# Altium schematic sheet TV_Measure.SchDoc
size A3; SheetNumber: 1; SheetTotal: 1
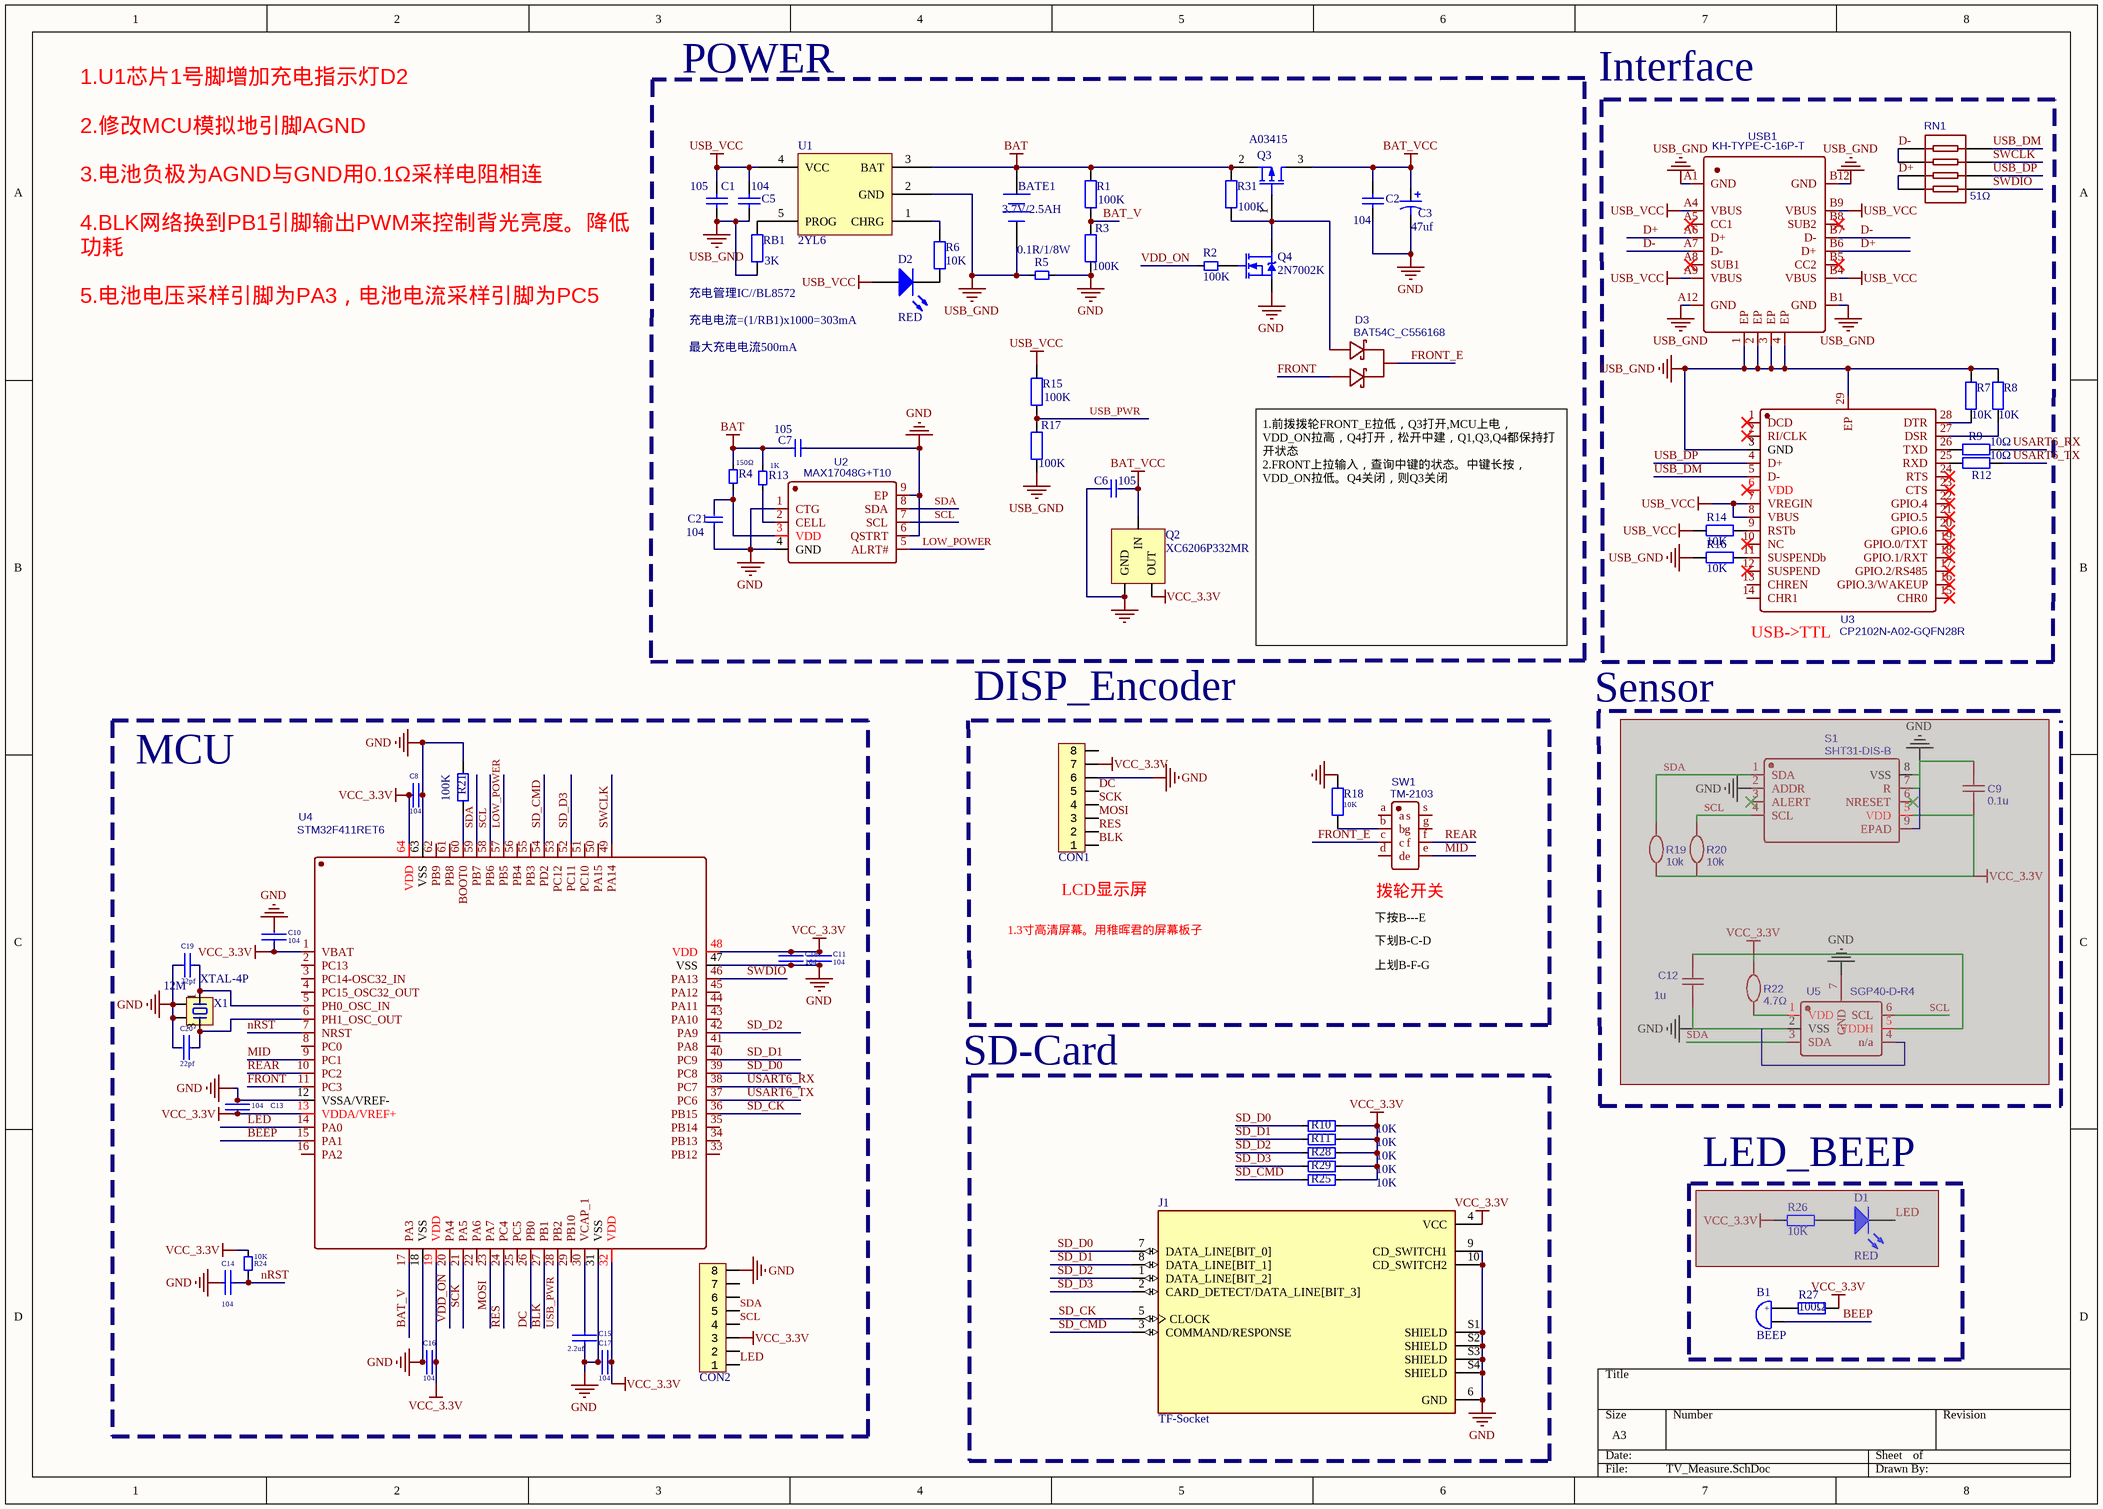
[diagram p0: TV_Measure.SchDoc]

## Parts
B1  BEEP  [BEEP_SMD5020]
BATE1  3.7V/2.5AH  [XH2/2.54mm/180]
C1  105  [0402_C]
C2  104  [0402_C]
C3  47uf  [TAJ-A/3216]
C5  104  [0402_C]
C6  105  [0402_C]
C7  105  [0402_C]
C8  104  [0402_C]
C9  0.1u  [0402_C]  (masked out: inside a compile mask, not in the netlist)
C10  104  [0402_C]
C11  104  [0402_C]
C12  1u  [0402_C]  (masked out: inside a compile mask, not in the netlist)
C13  104  [0402_C]
C14  104  [0402_C]
C15  2.2uf  [0402_C]
C16  104  [0402_C]
C17  104  [0402_C]
C18  104  [0402_C]
C19  22pf  [0402_C]
C20  22pf  [0402_C]
C21  104  [0402_C]
CON1  FFC_0.5_8  [FFC_0.5_8]  (value not drawn)
CON2  FFC_0.5_8  [FFC_0.5_8]  (value not drawn)
D1  RED  [LED_0402_BLUE]  (masked out: inside a compile mask, not in the netlist)
D2  RED  [LED_0402_BLUE]
D3  BAT54C_C556168  [SOT23_]
J1  TF-Socket  [TF_Card]
Q2  XC6206P332MR  [SOT23_]
Q3  A03415  [SOT23_]
Q4  2N7002K  [SOT23_]
R1  100K  [0402_R]
R2  100K  [0402_R]
R3  100K  [0402_R]
R4  150Ω  [0402_R]
R5  0.1R/1/8W  [0805R]
R6  10K  [0402_R]
R7  10K  [0402_R]
R8  10K  [0402_R]
R9  10Ω  [0402_R]
R10  10K  [0402_R]
R11  10K  [0402_R]
R12  10Ω  [0402_R]
R13  1K  [0402_R]
R14  10K  [0402_R]
R15  100K  [0402_R]
R16  10K  [0402_R]
R17  100K  [0402_R]
R18  10K  [0402_R]
R19  10k  [0402_R]  (masked out: inside a compile mask, not in the netlist)
R20  10k  [0402_R]  (masked out: inside a compile mask, not in the netlist)
R21  100K  [0402_R]
R22  4.7Ω  [0402_R]  (masked out: inside a compile mask, not in the netlist)
R24  10K  [0402_R]
R25  10K  [0402_R]
R26  10K  [0402_R]  (masked out: inside a compile mask, not in the netlist)
R27  100Ω  [0402_R]
R28  10K  [0402_R]
R29  10K  [0402_R]
R31  100K  [0402_R]
RB1  3K  [0402_R]
RN1  51Ω  [0603R*4_r]
S1  SHT31-DIS-B  [DFN8-P0.50]  (masked out: inside a compile mask, not in the netlist)
SW1  TM-2103  [WHEEL_SWITCH]
U1  2YL6  [SOT23-5_S]
U2  MAX17048G+T10  [DFN-8_L2.0-W2.0-P0.50-BL-EP]
U3  CP2102N-A02-GQFN28R  [QFN28]
U4  STM32F411RET6  [LQFP-64_L10.0-W10.0-P0.50-LS12.0-BL]
U5  SGP40-D-R4  [DFN-6_L2.4-W2.4-P0.80-TL-EP]  (masked out: inside a compile mask, not in the netlist)
USB1  KH-TYPE-C-16P-T  [TYPE-C-16P-T]
X1  XTAL-4P  [OSC 3225-4P]

## Blocks framed on the sheet
POWER: BATE1 C1-C3 C5-C7 C21 D2 D3 Q2-Q4 R1-R6 R13 R15 R17 R31 RB1 U1 U2
Interface: R7-R9 R12 R14 R16 RN1 U3 USB1
MCU: C8 C10 C11 C13-C20 CON2 R21 R24 U4 X1
LED_BEEP: B1 D1 R26 R27

## Nets
BAT: BATE1.1(+) C7.2 Q3.2 R1.2 R4.1 R13.1 R31.2 U1.3(BAT)
BAT_VCC: C2.2 C3.1 C6.1 Q2.3(IN) Q3.3
GND: C2.1 C3.2 C6.2 C7.1 C8.1 C10.1 C11.1 C13.1 C14.1 C15.1 C16.1 C17.1 C18.1 C19.1 C20.1 C21.2 CON1.6 CON2.8 J1.6(GND) J1.9(CD_SWITCH1) J1.10(CD_SWITCH2) J1.S1(SHIELD) J1.S2(SHIELD) J1.S3(SHIELD) J1.S4(SHIELD) Q2.1(GND) Q4.2(S) R3.1 R5.2 R18.2 R21.1 U2.1(CTG) U2.4(GND) U2.6(QSTRT) U2.9(EP) U4.12(VSSA/VREF-) U4.18(VSS) U4.31(VSS) U4.47(VSS) U4.63(VSS) X1.2 X1.4
USB_GND: BATE1.2(-) C1.2 C5.2 R5.1 R7.1 R8.1 R16.2 R17.1 RB1.1 U1.2(GND) U3.3(GND) U3.29(EP) USB1.1(EP) USB1.2(EP) USB1.3(EP) USB1.4(EP) USB1.A1(GND) USB1.A12(GND) USB1.B1(GND) USB1.B12(GND)
USB_VCC: C1.1 C5.1 D2.1(A) R14.1 R15.2 U1.4(VCC) U3.7(VREGIN) U3.8(VBUS) USB1.A4(VBUS) USB1.A9(VBUS) USB1.B4(VBUS) USB1.B9(VBUS)
VCC_3.3V: C8.2 C10.2 C11.2 C13.2 C16.2 C17.2 C18.2 CON1.7 CON2.3 J1.4(VCC) Q2.2(OUT) R10.1 R11.1 R24.2 R25.1 R27.1 R28.1 R29.1 U4.1(VBAT) U4.13(VDDA/VREF+) U4.19(VDD) U4.32(VDD) U4.48(VDD) U4.64(VDD)
BAT_V: R1.1 R3.2 U4.17(PA3)
BEEP: B1.2 U4.15(PA1)
BLK: CON1.1 U4.27(PB1)
D+: RN1.3 RN1.4 USB1.A6(D+) USB1.B6(D+)
D-: RN1.1 RN1.2 USB1.A7(D-) USB1.B7(D-)
DC: CON1.5 U4.26(PB0)
FRONT: D3.2(+) U4.11(PC3)
FRONT_E: D3.3(-) SW1.c
LED: CON2.1 U4.14(PA0)
LOW_POWER: U2.5(ALRT#) U4.57(PB5)
MID: SW1.e U4.9(PC1)
MOSI: CON1.3 U4.23(PA7)
nRST: C14.2 R24.1 U4.7(NRST)
REAR: SW1.f U4.10(PC2)
RES: CON1.2 U4.24(PC4)
SCK: CON1.4 U4.21(PA5)
SCL: CON2.4 U2.7(SCL) U4.58(PB6)
SD_CK: J1.5(CLOCK) U4.36(PB15)
SD_CMD: J1.3(COMMAND/RESPONSE) R25.2 U4.54(PD2)
SD_D0: J1.7(DATA_LINE[BIT_0]) R10.2 U4.39(PC8)
SD_D1: J1.8(DATA_LINE[BIT_1]) R11.2 U4.40(PC9)
SD_D2: J1.1(DATA_LINE[BIT_2]) R28.2 U4.42(PA9)
SD_D3: J1.2(CARD_DETECT/DATA_LINE[BIT_3]) R29.2 U4.52(PC11)
SDA: CON2.5 U2.8(SDA) U4.59(PB7)
SWCLK: RN1.7 U4.49(PA14)
SWDIO: RN1.5 U4.46(PA13)
USART6_RX: R9.2 U4.38(PC7)
USART6_TX: R12.2 U4.37(PC6)
USB_DM: RN1.8 U3.5(D-)
USB_DP: RN1.6 U3.4(D+)
USB_PWR: R15.1 R17.2 U4.28(PB2)
VDD_ON: R2.2 U4.20(PA4)
NetB1_1: B1.1 R27.2
NetC15_2: C15.2 U4.30(VCAP_1)
NetC19_2: C19.2 U4.5(PH0_OSC_IN) X1.1
NetC20_2: C20.2 U4.6(PH1_OSC_OUT) X1.3
NetC21_1: C21.1 R4.2 U2.3(VDD)
NetD2_2: D2.2(K) R6.2
NetD3_1: D3.1(+) Q3.1 Q4.3(D) R31.1
NetQ4_1: Q4.1(G) R2.1
NetR6_1: R6.1 U1.1(CHRG)
NetR7_2: R7.2 U3.28(DTR)
NetR8_2: R8.2 U3.27(DSR)
NetR9_1: R9.1 U3.26(TXD)
NetR12_1: R12.1 U3.25(RXD)
NetR13_2: R13.2 U2.2(CELL)
NetR14_2: R14.2 U3.9(RSTb)
NetR16_1: R16.1 U3.11(SUSPENDb)
NetR18_1: R18.1 SW1.b
NetR21_2: R21.2 U4.60(BOOT0)
NetRB1_2: RB1.2 U1.5(PROG)

Not connected (* = marked no-connect by the designer): CON1 8; CON2 2 6 7; SW1 a d g s; U3 1(DCD)* 2(RI/CLK)* 6(VDD)* 10(NC)* 12(SUSPEND)* 13(CHREN) 14(CHR1) 15(CHR0)* 16(GPIO.3/WAKEUP)* 17(GPIO.2/RS485)* 18(GPIO.1/RXT)* 19(GPIO.0/TXT)* 20(GPIO.6)* 21(GPIO.5)* 22(GPIO.4)* 23(CTS)* 24(RTS)*; U4 2(PC13) 3(PC14-OSC32_IN) 4(PC15_OSC32_OUT) 8(PC0) 16(PA2) 22(PA6) 25(PC5) 29(PB10) 33(PB12) 34(PB13) 35(PB14) 41(PA8) 43(PA10) 44(PA11) 45(PA12) 50(PA15) 51(PC10) 53(PC12) 55(PB3) 56(PB4) 61(PB8) 62(PB9); USB1 A5(CC1)* A8(SUB1)* B5(CC2)* B8(SUB2)*

## Notes on the sheet
- (near RB1) 充电管理IC//BL8572
- 充电电流=(1/RB1)x1000=303mA
- 最大充电电流500mA
- (near D3) 1.前拨拨轮FRONT_E拉低，Q3打开,MCU上电，VDD_ON拉高，Q4打开，松开中建，Q1,Q3,Q4都保持打开状态
  2.FRONT上拉输入，查询中键的状态。中键长按，VDD_ON拉低。Q4关闭，则Q3关闭
- (near U3) USB->TTL
- 1.U1芯片1号脚增加充电指示灯D2
  2.修改MCU模拟地引脚AGND
  3.电池负极为AGND与GND用0.1Ω采样电阻相连
  4.BLK网络换到PB1引脚输出PWM来控制背光亮度。降低功耗
  5.电池电压采样引脚为PA3，电池电流采样引脚为PC5
- (near CON1) DISP_Encoder
- Sensor
- (near CON1) LCD显示屏
- (near SW1) 下按B---E
- (near SW1) 拨轮开关
- 12M
- 1.3寸高清屏幕。用稚晖君的屏幕板子
- 下划B-C-D
- 上划B-F-G
- SD-Card
- (in symbol BEEP) +

## Library data of the parts
B1 = BEEP: 蜂鸣器
BATE1 = Battery: Multicell Battery; Published: 24-Mar-1999; LatestRevisionDate: 17-Jul-2002; LatestRevisionNote: Re-released for DXP Platform.; PackageReference: BAT-2; Publisher: Altium Limited
C1 C2 C5 = Cap: Capacitor; Published: 8-Jun-2000; LatestRevisionDate: 17-Jul-2002; LatestRevisionNote: Re-released for DXP Platform.; PackageReference: RAD-0.3; Publisher: Altium Limited
  C1: Value: 105
  C2 C5: Value: 104
C3 = Cap Pol3: Polarized Capacitor (Surface Mount); Value: 100pF; Published: 8-Jun-2000; LatestRevisionDate: 29-May-2009; LatestRevisionNote: IPC-7351 Footprint Added.; PackageReference: C0805; Publisher: Altium Limited; PackageDescription: Chip Capacitor
C6-C8 C10 C11 C13-C21 = C103
C9 = 0.1u: nameAlias: Value(F); Contributor: LCEDA_Lib; spicePre: C; spiceSymbolName: C_0402_US
C12 = 1u: nameAlias: Value(F); Contributor: LCEDA_Lib; spicePre: C; spiceSymbolName: C_0402_US
CON1 CON2 = FFC_0.5_8: FFC; System: Connector
D1 D2 = LED0: Typical INFRARED GaAs LED; Published: 8-Jun-2000; LatestRevisionDate: 08-Jul-2005; LatestRevisionNote: Mech Layer 1 removed.; PackageReference: LED-0; Publisher: Altium Limited; Value: RED
D3 = BAT54C_C556168: BOM_Manufacturer: Slkor(SLKORMICRO Elec.); BOM_Manufacturer Part: BAT54C; Contributor: LCSC; BOM_Supplier: LCSC; BOM_Supplier Part: C556168; BOM_JLCPCB Part Class: Extended Part; spicePre: D; spiceSymbolName: BAT54C_C556168
J1 = TF-Socket: 10 _8 + 2_ Position Card Connector Secure Digital - microSDâ„¢ Surface Mount, Right Angle Gold; MP: 1140084168; MF: Amphenol Commercial Products; SnapEDA_Link: https://www.snapeda.com/parts/1140084168/Amphenol/view-part/4544529/?ref=snap; Availability: Unavailable; Price: None; Value: *; Package: None
Q2 = XC6206_3.3
Q3 = MOSFET-P: P-Channel MOSFET; Published: 8-Jun-2000; LatestRevisionDate: 17-Jul-2002; LatestRevisionNote: Re-released for DXP Platform.; PackageVersion: 1995/1996; PackageReference: E3; Publisher: Altium Limited
Q4 = N-MOS: N沟道场效应管
R1 R3 R7-R9 R12 R15-R18 R21 R26 R27 R31 = Res2: Resistor; Published: 8-Jun-2000; LatestRevisionDate: 17-Jul-2002; LatestRevisionNote: Re-released for DXP Platform.; PackageReference: AXIAL-0.4; Publisher: Altium Limited
  R1 R3 R15 R17 R21: Value: 100K
  R7 R8 R16 R18 R26: Value: 10K
  R9 R12: Value: 10Ω
  R27: Value: 100Ω
R2 R4 R5 R13 R24 = R10K
R6 = Res2: Resistor; Value: 100K; Published: 8-Jun-2000; LatestRevisionDate: 17-Jul-2002; LatestRevisionNote: Re-released for DXP Platform.; PackageReference: AXIAL-0.4; Publisher: Altium Limited
R10 R11 R25 R28 R29 = 电阻-0402: Resistor; Value: 22R
R14 = Res2: Resistor; Value: 4.7K; Published: 8-Jun-2000; LatestRevisionDate: 17-Jul-2002; LatestRevisionNote: Re-released for DXP Platform.; PackageReference: AXIAL-0.4; Publisher: Altium Limited
R19 R20 = 10k: nameAlias: Value(Ω); Contributor: LCEDA_Lib; spicePre: R; spiceSymbolName: R_0402_EU
R22 = 4.7Ω: nameAlias: Value(Ω); Contributor: LCEDA_Lib; spicePre: R; spiceSymbolName: R_0402_EU
RB1 = Res2: Resistor; Value: 3.3K; Published: 8-Jun-2000; LatestRevisionDate: 17-Jul-2002; LatestRevisionNote: Re-released for DXP Platform.; PackageReference: AXIAL-0.4; Publisher: Altium Limited
RN1 = 51Ω: BOM_Manufacturer: RALEC; BOM_Manufacturer Part: RTA03-4D510JTP; nameAlias: Resistance; Resistance (Ohms): 51; BOM_Supplier: LCSC; BOM_Supplier Part: C102676; BOM_JLCPCB Part Class: Extended Part; spicePre: R; spiceSymbolName: RTA03-4D510JTP
S1 = SHT31-DIS-B: BOM_Manufacturer: Sensirion; BOM_Supplier: LCSC; BOM_Manufacturer Part: SHT31-DIS-B; BOM_Supplier Part: C80862; BOM_JLCPCB Part Class: Extended Part; spicePre: S; spiceSymbolName: SHT31-DIS-B
SW1 = TM-2103: BOM_Manufacturer: XKB Enterprise; Contributor: LCSC; BOM_Supplier: LCSC; BOM_Supplier Part: C318947; BOM_Manufacturer Part: TM-2103; BOM_JLCPCB Part Class: Extended Part; spicePre: S; spiceSymbolName: TM-2103
U2 = MAX17048G+T10: BOM_Manufacturer: MAXIM(美信); Contributor: LCSC; BOM_Supplier: LCSC; BOM_Supplier Part: C2682616; BOM_Manufacturer Part: MAX17048G+T10; BOM_JLCPCB Part Class: Extended Part; spicePre: U; spiceSymbolName: MAX17048G+T10
U3 = CP2102N-A02-GQFN28R: BOM_Manufacturer: SILICON LABS(芯科); Contributor: LCSC; BOM_Supplier: LCSC; BOM_Supplier Part: C964632; BOM_Manufacturer Part: CP2102N-A02-GQFN28R; BOM_JLCPCB Part Class: Extended Part; spicePre: U; spiceSymbolName: CP2102N-A02-GQFN28R
U4 = STM32F411RET6: BOM_Manufacturer: STMicroelectronics; BOM_Supplier: LCSC; BOM_Manufacturer Part: STM32F411RET6; BOM_Supplier Part: C94355; BOM_JLCPCB Part Class: Extended Part; spicePre: U; spiceSymbolName: STM32F411RET6
U5 = SGP40-D-R4: BOM_Manufacturer: null; Contributor: LCSC; BOM_Supplier: LCSC; BOM_Supplier Part: C2874215; BOM_Manufacturer Part: SGP40-D-R4; BOM_JLCPCB Part Class: Extended Part; spicePre: U; spiceSymbolName: SGP40-D-R4
USB1 = KH-TYPE-C-16P-T: BOM_Manufacturer: Shenzhen Kinghelm Elec; Contributor: LCSC; BOM_Supplier: LCSC; BOM_Supplier Part: C709358; BOM_Manufacturer Part: KH-TYPE-C-16P-T; BOM_JLCPCB Part Class: Extended Part; spicePre: U; spiceSymbolName: KH-TYPE-C-16P-T
X1 = XTAL-4P: 4脚无源晶振